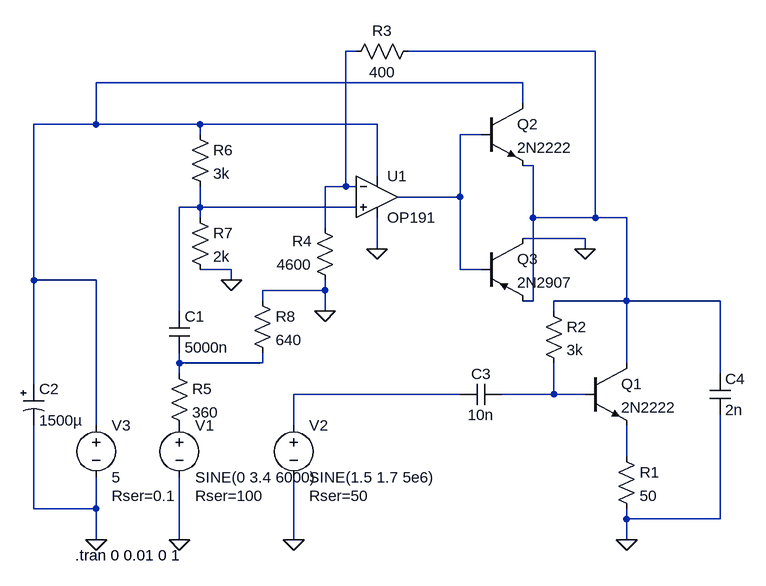
[diagram p0: schematic Test_AM_Tansceiver.asc]
Test_AM_Tansceiver.asc, the LTspice schematic file:
Version 4
SHEET 1 880 680
WIRE -64 -432 -80 -432
WIRE 304 -432 16 -432
WIRE 192 -384 -464 -384
WIRE 192 -352 192 -384
WIRE -464 -320 -464 -384
WIRE -464 -320 -560 -320
WIRE -304 -320 -464 -320
WIRE -32 -320 -304 -320
WIRE -304 -304 -304 -320
WIRE 128 -304 96 -304
WIRE 208 -256 192 -256
WIRE -32 -240 -32 -320
WIRE -80 -224 -80 -432
WIRE -80 -224 -112 -224
WIRE -64 -224 -80 -224
WIRE 96 -208 96 -304
WIRE 96 -208 0 -208
WIRE -304 -192 -304 -224
WIRE -304 -192 -336 -192
WIRE -64 -192 -304 -192
WIRE -304 -176 -304 -192
WIRE 208 -176 208 -256
WIRE 304 -176 304 -432
WIRE 304 -176 208 -176
WIRE 352 -176 304 -176
WIRE -112 -160 -112 -224
WIRE 288 -144 192 -144
WIRE -32 -128 -32 -176
WIRE 288 -128 288 -144
WIRE -256 -96 -304 -96
WIRE 96 -96 96 -208
WIRE 128 -96 96 -96
WIRE -560 -80 -560 -320
WIRE -464 -80 -560 -80
WIRE -256 -80 -256 -96
WIRE -112 -64 -112 -80
WIRE -112 -64 -208 -64
WIRE -208 -48 -208 -64
WIRE 208 -48 208 -176
WIRE 208 -48 192 -48
WIRE 352 -48 352 -176
WIRE 352 -48 240 -48
WIRE 496 -48 352 -48
WIRE -336 -32 -336 -192
WIRE -112 -32 -112 -64
WIRE 240 -32 240 -48
WIRE -336 48 -336 32
WIRE -208 48 -208 32
WIRE -208 48 -336 48
WIRE 352 48 352 -48
WIRE -336 64 -336 48
WIRE 496 64 496 -48
WIRE -560 80 -560 -80
WIRE 96 96 -160 96
WIRE 240 96 240 48
WIRE 240 96 160 96
WIRE 288 96 240 96
WIRE -464 144 -464 -80
WIRE -160 144 -160 96
WIRE 352 192 352 144
WIRE -560 272 -560 144
WIRE -464 272 -464 224
WIRE -464 272 -560 272
WIRE 352 288 352 272
WIRE 496 288 496 128
WIRE 496 288 352 288
WIRE -464 320 -464 272
WIRE -336 320 -336 224
WIRE -160 320 -160 224
WIRE 352 320 352 288
FLAG -336 320 0
FLAG -160 320 0
FLAG 352 320 0
FLAG -464 320 0
FLAG -32 -128 0
FLAG -256 -80 0
FLAG 288 -128 0
FLAG -112 -32 0
SYMBOL npn 288 48 R0
SYMATTR InstName Q1
SYMATTR Value 2N2222
SYMBOL voltage -336 128 R0
WINDOW 123 0 0 Left 0
WINDOW 39 24 124 Left 2
SYMATTR SpiceLine Rser=100
SYMATTR InstName V1
SYMATTR Value SINE(0 3.4 6000)
SYMBOL voltage -160 128 R0
WINDOW 123 0 0 Left 0
WINDOW 39 24 124 Left 2
SYMATTR SpiceLine Rser=50
SYMATTR InstName V2
SYMATTR Value SINE(1.5 1.7 5e6)
SYMBOL voltage -464 128 R0
WINDOW 123 0 0 Left 0
WINDOW 39 24 124 Left 2
SYMATTR SpiceLine Rser=0.1
SYMATTR InstName V3
SYMATTR Value 5
SYMBOL res -320 -320 R0
SYMATTR InstName R6
SYMATTR Value 3k
SYMBOL res -320 -192 R0
SYMATTR InstName R7
SYMATTR Value 2k
SYMBOL cap -352 -32 R0
SYMATTR InstName C1
SYMATTR Value 5000n
SYMBOL Opamps\\OP191 -32 -272 R0
SYMATTR InstName U1
SYMBOL pnp 128 -144 R0
SYMATTR InstName Q3
SYMATTR Value 2N2907
SYMBOL npn 128 -352 R0
SYMATTR InstName Q2
SYMATTR Value 2N2222
SYMBOL polcap -576 80 R0
WINDOW 3 24 56 Left 2
SYMATTR Value 1500µ
SYMATTR InstName C2
SYMATTR Description Capacitor
SYMATTR Type cap
SYMATTR SpiceLine V=6.3 Irms=1.19 Rser=0.055 Lser=0 mfg="Panasonic" pn="ECA0JFQ152" type="Al electrolytic"
SYMBOL res 336 176 R0
SYMATTR InstName R1
SYMATTR Value 50
SYMBOL res 32 -448 R90
WINDOW 0 0 56 VBottom 2
WINDOW 3 32 56 VTop 2
SYMATTR InstName R3
SYMATTR Value 400
SYMBOL res -96 -64 R180
WINDOW 0 36 76 Left 2
WINDOW 3 36 40 Left 2
SYMATTR InstName R4
SYMATTR Value 4600
SYMBOL cap 160 80 R90
WINDOW 0 0 32 VBottom 2
WINDOW 3 32 32 VTop 2
SYMATTR InstName C3
SYMATTR Value 10n
SYMBOL res 224 -48 R0
SYMATTR InstName R2
SYMATTR Value 3k
SYMBOL cap 480 64 R0
SYMATTR InstName C4
SYMATTR Value 2n
SYMBOL res -352 48 R0
SYMATTR InstName R5
SYMATTR Value 360
SYMBOL res -224 -64 R0
SYMATTR InstName R8
SYMATTR Value 640
TEXT -496 344 Left 2 !.tran 0 0.01 0 1

The netlist it stands for:
* Test_AM_Tansceiver.asc
Q1 N002 N008 N009 0 2N2222
V1 P001 0 SINE(0 3.4 6000) Rser=100
V2 N007 0 SINE(1.5 1.7 5e6) Rser=50
V3 N003 0 5 Rser=0.1
R6 N003 N005 3k
R7 N005 0 2k
C1 N005 N006 5000n
XU1 N005 N001 N003 0 N004 OP191  ; pins In+ In- V+ V- OUT
Q3 0 N004 N002 0 2N2907
Q2 N003 N004 N002 0 2N2222
C2 N003 0 1500µ V=6.3 Irms=1.19 Rser=0.055 Lser=0 mfg="Panasonic" pn="ECA0JFQ152" type="Al electrolytic"
R1 N009 0 50
R3 N002 N001 400
R4 0 N001 4600
C3 N008 N007 10n
R2 N002 N008 3k
C4 N002 0 2n
R5 N006 P001 360
R8 0 N006 640
.model NPN NPN
.model PNP PNP
.lib standard.bjt
.tran 0 0.01 0 1
.lib ADI.lib
.backanno
.end